# Altium schematic sheet Top.SchDoc
size A; SheetNumber: 1; SheetTotal: 1
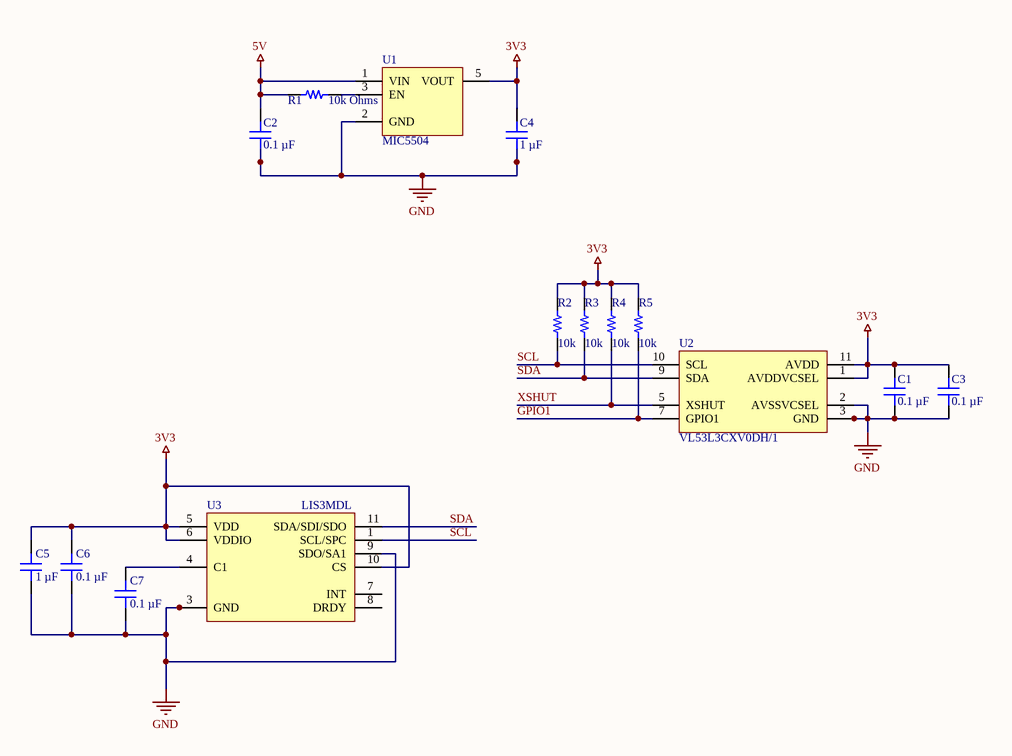
[diagram p0: Top.SchDoc]

## Parts
C1  0.1 µF  [CAP 0402_1005]
C2  0.1 µF  [CAP 0402_1005]
C3  0.1 µF  [CAP 0402_1005]
C4  1 µF  [CAP 0402_1005]
C5  1 µF  [CAP 0402_1005]
C6  0.1 µF  [CAP 0402_1005]
C7  0.1 µF  [CAP 0402_1005]
R1  10k Ohms  [RES 0402_1005]
R2  10k  [RES 0402_1005]
R3  10k  [RES 0402_1005]
R4  10k  [RES 0402_1005]
R5  10k  [RES 0402_1005]
U1  MIC5504  [TI SOT-23-5 DBV]
U2  VL53L3CXV0DH/1  [XDCR_VL53L3CXV0DH/1]
U3  LIS3MDL  [LGA12_ST]

## Nets
3V3: C1.2 C3.2 C4.2 C5.1 C6.1 R2.1 R3.1 R4.1 R5.1 U1.5(VOUT) U2.1(AVDDVCSEL) U2.11(AVDD) U3.5(VDD) U3.6(VDDIO) U3.10(CS)
5V: C2.2 R1.2 U1.1(VIN)
GND: C1.1 C2.1 C3.1 C4.1 C5.2 C6.2 C7.2 U1.2(GND) U2.2(AVSSVCSEL) U2.3(GND) U2.4(GND) U2.6(GND) U2.12(GND) U3.2(Reserved) U3.3(GND) U3.9(SDO/SA1) U3.12(Reserved)
GPIO1: R5.2 U2.7(GPIO1)
SCL: R2.2 U2.10(SCL) U3.1(SCL/SPC)
SDA: R3.2 U2.9(SDA) U3.11(SDA/SDI/SDO)
XSHUT: R4.2 U2.5(XSHUT)
NetC7_1: C7.1 U3.4(C1)
NetR1_1: R1.1 U1.3(EN)

Not connected (* = marked no-connect by the designer): U3 7(INT) 8(DRDY)

## Library data of the parts
C1-C3 C6 C7 = C0402C104K4RACAUTO: CAP CER 0.1UF 16V X7R 0402; manufacturer: KEMET; Tolerance: ±10%; Part Number: C0402C104K4RACAUTO; Value: 0.1 µF; Applications: Automotive, Bypass, Decoupling; Capacitance: 0.1 µF; componentlink1description: Datasheet; componentlink1url: https://api.kemet.com/component-edge/download/specsheet/C0402C104K4RACAUTO.pdf; componentlink2description: DigiKey Link; componentlink2url: https://www.digikey.com/en/products/detail/kemet/C0402C104K4RACAUTO/3314827; Device Package: 0402 (1005 Metric); lastupdated: 8/14/2022 9:05:51 PM; Lifecycle Status: Active; Minimum Order: 1; Mounting Type: Surface Mount, MLCC; Operating Temperature: -55°C ~ 125°C; Package / Case: 0402 (1005 Metric); packaging: TapeAndReel; partid: 3024; Part Status: Active; price: 0.01; Ratings: AEC-Q200; series: SMD Auto X7R; Size / Dimension: 0.039" L x 0.020" W (1.00mm x 0.50mm); Supplier 1: DigiKey; Supplier Part Number 1: 399-6828-1-ND; Temperature Coefficient: X7R; Thickness (Max): 0.022" (0.55mm); Voltage - Rated: 16V
C4 C5 = C0402C104K4RACAUTO: CAP CER 0.1UF 16V X7R 0402; manufacturer: KEMET; Capacitance: 0.1 µF; Tolerance: ±10%; Part Number: C0402C104K4RACAUTO; Value: 1 µF; Applications: Automotive, Bypass, Decoupling; componentlink1description: Datasheet; componentlink1url: https://api.kemet.com/component-edge/download/specsheet/C0402C104K4RACAUTO.pdf; componentlink2description: DigiKey Link; componentlink2url: https://www.digikey.com/en/products/detail/kemet/C0402C104K4RACAUTO/3314827; Device Package: 0402 (1005 Metric); lastupdated: 8/14/2022 9:05:51 PM; Lifecycle Status: Active; Minimum Order: 1; Mounting Type: Surface Mount, MLCC; Operating Temperature: -55°C ~ 125°C; Package / Case: 0402 (1005 Metric); packaging: TapeAndReel; partid: 3024; Part Status: Active; price: 0.01; Ratings: AEC-Q200; series: SMD Auto X7R; Size / Dimension: 0.039" L x 0.020" W (1.00mm x 0.50mm); Supplier 1: DigiKey; Supplier Part Number 1: 399-6828-1-ND; Temperature Coefficient: X7R; Thickness (Max): 0.022" (0.55mm); Voltage - Rated: 16V
R1-R5 = CRCW0402330RJNEDC: RES 330 OHM 5% 1/16W 0402; Manufacturer: Vishay Dale; Power (Watts): 0.063W, 1/16W; Resistance: 330 Ohms; Temperature Coefficient: ±200ppm/°C; Part Number: CRCW0402330RJNEDC; ComponentLink1Description: Datasheet; ComponentLink1URL: http://www.vishay.com/docs/28773/crcwce3.pdf; ComponentLink2Description: DigiKey Link; ComponentLink2URL: https://www.digikey.com/en/products/detail/vishay-dale/CRCW0402330RJNEDC/7928545; Composition: Thick Film; Device Package: 0402 (1005 Metric); Height - Seated (Max): 0.014" (0.35mm); LastUpdated: 8/14/2022 9:23:31 PM; Lifecycle Status: Active; Minimum Order: 1; Number of Terminations: 2; Operating Temperature: -55°C ~ 155°C; Package / Case: 0402 (1005 Metric); Packaging: CutTape; PartId: 15989; Part Status: Active; Price: 0.01; Series: CRCW-C; Size / Dimension: 0.039" L x 0.020" W (1.00mm x 0.50mm); Supplier 1: DigiKey; Supplier Part Number 1: 541-4123-1-ND; Supplier Device Package: 0402; Tolerance: ±5%
  R1: Value: 10k Ohms
  R2-R5: Value: 10k
U1 = MIC5504-3.3YM5: 3.3V LDO
U2 = VL53L3CXV0DH/1: Optical Sensor 118.110 (3m) I2C Output; MF: STMicroelectronics; Value: *; Availability: Unavailable; Package: None; SnapEDA_Link: https://www.snapeda.com/parts/VL53L3CXV0DH/1/STMicroelectronics/view-part/4775788/?ref=snap; MP: VL53L3CXV0DH/1; Price: None
U3 = LIS3MDL: Magnetometer